# Altium schematic sheet motorcontroller updated (3).SchDoc
size A; SPICEModelCacheTQSCEQAL: <root> / <DocumentId>TQSCEQAL</DocumentId> / </root>
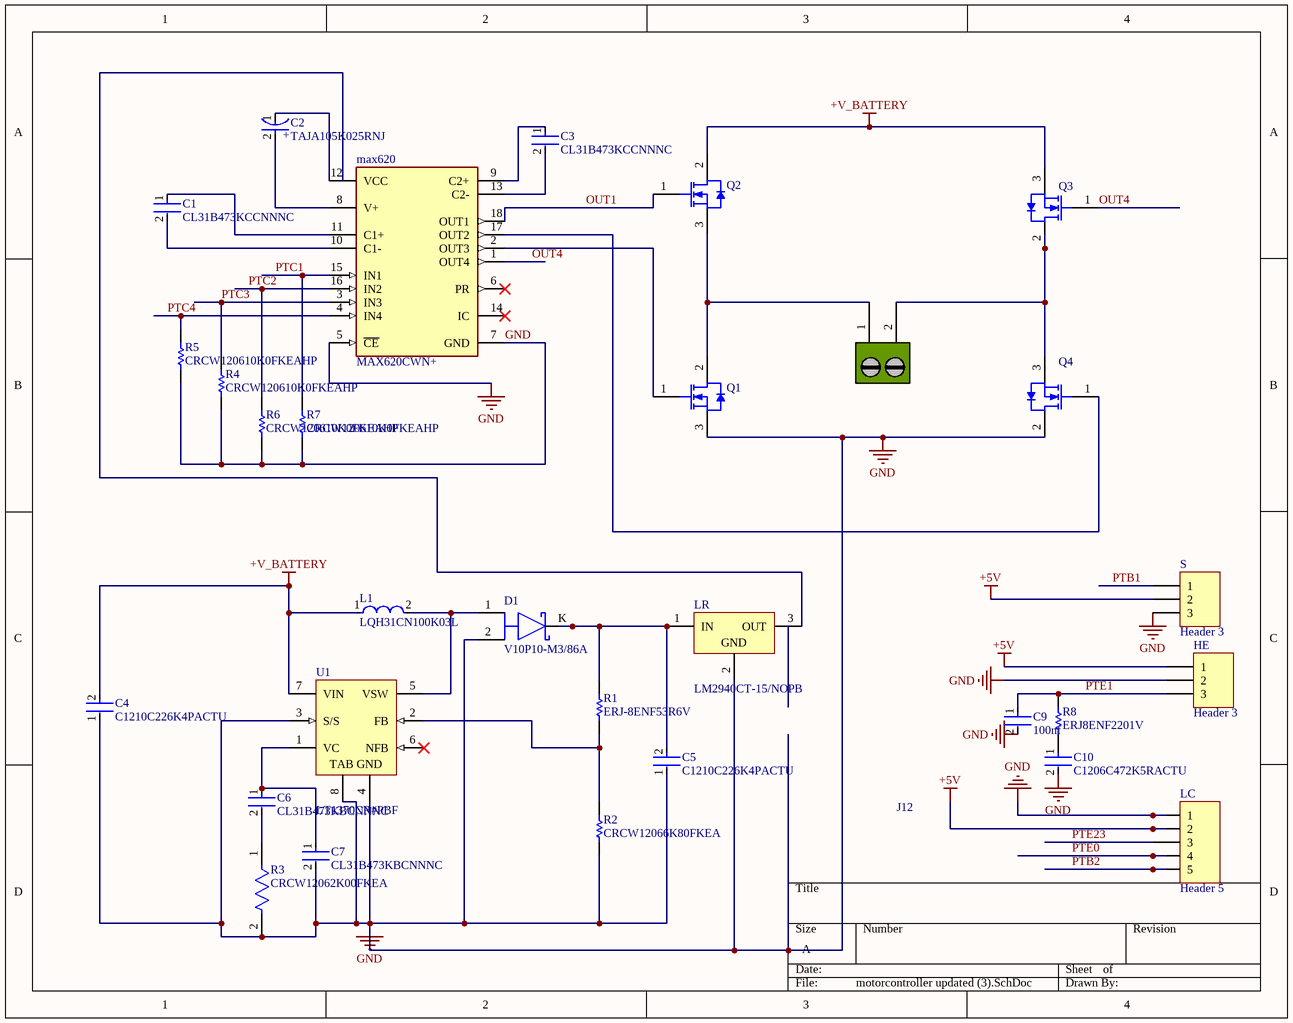
[diagram p0: motorcontroller updated (3).SchDoc]

## Parts
C1  CL31B473KCCNNNC  [FP-CL31-IPC_B]
C2  TAJA105K025RNJ  [FP-TAJA-MFG]
C3  CL31B473KCCNNNC  [FP-CL31-IPC_B]
C4  C1210C226K4PACTU  [FP-C1210C226K4PACTU-MFG]
C5  C1210C226K4PACTU  [FP-C1210C226K4PACTU-MFG]
C6  CL31B473KBCNNNC  [FP-CL31-IPC_B]
C7  CL31B473KBCNNNC  [FP-CL31-IPC_B]
C9  100nf  [FP-CL31-IPC_C]
C10  C1206C472K5RACTU  [FP-C1206C-EB-MFG]
D1  V10P10-M3/86A  [FP-95570-MFG]
HE  Header 3  [HDR1X3]
J12  (no value)  [282857-2]
L1  LQH31CN100K03L  [FP-LQH31CN_03-MFG]
LC  Header 5  [HDR1X5]
LR  LM2940CT-15/NOPB  [NDE0003A]
max620  MAX620CWN+  [FP-W18-1-MFG]
Q1  (no value)  [INF-PG-TO252-3-11_A_M]
Q2  (no value)  [INF-PG-TO252-3-11_A_M]
Q3  (no value)  [INF-PG-TO252-3-11_A_M]
Q4  (no value)  [INF-PG-TO252-3-11_A_M]
R1  ERJ-8ENF53R6V  [RESC3216X70X50NL05T20]
R2  CRCW12066K80FKEA  [RESC3216X60X45LL10T20]
R3  CRCW12062K00FKEA  [FP-CRCW1206-e3-IPC_A]
R4  CRCW120610K0FKEAHP  [RESC3116X65X50NL20T20]
R5  CRCW120610K0FKEAHP  [RESC3116X65X50NL20T20]
R6  CRCW120610K0FKEAHP  [RESC3116X65X50NL20T20]
R7  CRCW120610K0FKEAHP  [RESC3116X65X50NL20T20]
R8  ERJ8ENF2201V  [RESC3216X70X50NL05T20]
S  Header 3  [HDR1X3]
U1  LT1370CR#PBF  [LT-R-7_L]

## Nets
+5V: HE.1 LC.2 S.2
+V_BATTERY: C4.2 L1.1 Q2.2(DRAIN) Q3.3(SOURCE) U1.7(VIN)
GND: C4.1 C5.1 C7.2 C9.2 C10.2 D1.2(A) HE.2 LC.1 LR.2(GND) max620.5(~{CE}) max620.7(GND) Q1.3(SOURCE) Q4.2(DRAIN) R2.2 R3.2 R4.2 R5.1 R6.1 R7.2 S.3 U1.3(S/S) U1.4(GND) U1.8(TAB)
OUT1: max620.18(OUT1) Q2.1(GATE)
OUT4: max620.1(OUT4) Q3.1(GATE)
PTB1: S.1
PTB2: LC.5
PTC1: max620.15(IN1) R7.1
PTC2: max620.16(IN2) R6.2
PTC3: max620.3(IN3) R4.1
PTC4: max620.4(IN4) R5.2
PTE0: LC.4
PTE1: C9.1 HE.3 R8.2
PTE23: LC.3
NetC1_1: C1.1 max620.11(C1+)
NetC1_2: C1.2 max620.10(C1-)
NetC2_1: C2.1(C) max620.12(VCC)
NetC2_2: C2.2(A) max620.8(V+)
NetC3_1: C3.1 max620.9(C2+)
NetC3_2: C3.2 max620.13(C2-)
NetC5_2: C5.2 D1.K(C) LR.1(IN) R1.2
NetC6_1: C6.1 C7.1 U1.1(VC)
NetC6_2: C6.2 R3.1
NetC10_1: C10.1 R8.1
NetD1_1: D1.1(A) L1.2 U1.5(VSW)
NetJ12_1: J12.1 Q1.2(DRAIN) Q2.3(SOURCE)
NetJ12_2: J12.2 Q3.2(DRAIN) Q4.3(SOURCE)
Netmax620_2: max620.2(OUT3) Q1.1(GATE)
Netmax620_17: max620.17(OUT2) Q4.1(GATE)
NetR1_1: R1.1 R2.1 U1.2(FB)

Not connected (* = marked no-connect by the designer): LR 3(OUT); max620 6(PR)* 14(IC)*; U1 6(NFB)*

## Notes on the sheet
- (in symbol CMP-04424-000374-1) +

## Library data of the parts
C1 C3 = CMP-13271-001626-1: Cap Ceramic 47nF 100V X7R ±10% SMD 1206 +125°C Embossed T/R; Voltage: 63V; Mount: Surface Mount; Tolerance: 10%; Case Code (Imperial): 1206; Radiation Hardening: No; Material: Ceramic; Case Code (Metric): 3216; Voltage Rating: 100V; Packaging: Tape and Reel; Width: 0.063inch; Case/Package: 1206; Thickness: 0.039inch; Length: 3.2mm; Capacitance: 47nF; Max Operating Temperature: 125°C; Depth: 1.6mm; Height: 0.85mm; Dielectric: X7R; Package Quantity: 1; Min Operating Temperature: -55°C
C2 = CMP-04424-000374-1: 1uF 25V  ±10% 8Ω 1206  SMD Tantalum Capacitor; ESR (Equivalent Series Resistance): 8R; Leakage Current: 500nA; Dissipation Factor: 4%; Polarity: Polar; Tolerance: 20%; Dielectric: X7R; Termination: SMD/SMT; Series: TAJ; Depth: 1.6mm; Voltage Rating (DC): 25V; RoHS Compliant: Yes; Number of Pins: 2; Mount: Surface Mount; Case/Package: 1206; Features: General Purpose; Length: 3.2mm; Height - Seated (Max): 0.071inch; Dielectric Material: Tantalum; Width: 1.6mm; Case Code (Metric): 3216; Min Operating Temperature: -55°C; Max Operating Temperature: 125°C; Radiation Hardening: No; Capacitance: 1uF; Construction: Flat; Voltage: 25V; Height: 1.6mm; Package Quantity: 1; REACH SVHC: No SVHC; Packaging: Tape and Reel; Voltage Rating: 25V; Case Code (Imperial): 1206; Lead Free: Lead Free; Weight: 0.000571oz
C4 C5 = CMP-03020-034645-1: CAP CER 22UF 16V X5R 1210; Tolerance: 10%; Dielectric Material: Ceramic; Case Code (Metric): 3225; Mount: Surface Mount; Voltage: 16V; Construction: Flat; Lead Free: Lead Free; Radiation Hardening: No; Case Code (Imperial): 1210; Min Operating Temperature: -55°C; Height: 1.85mm; Termination: SMD/SMT; Voltage Rating (DC): 16V; Length: 3.2mm; Voltage Rating: 16V; Max Operating Temperature: 85°C; Packaging: Tape and Reel; RoHS Compliant: Yes; Capacitance: 22uF; Depth: 2.5mm; Case/Package: 1210; Dielectric: X5R
C6 C7 = CMP-13271-000358-1: Cap Ceramic 47nF 50V X7R ±10% SMD 1206 +125°C Embossed T/R; Case Code (Metric): 3216; Depth: 1.6mm; Mount: Surface Mount; Min Operating Temperature: -55°C; Case/Package: 1206; Height: 0.85mm; Packaging: Tape and Reel; Thickness: 0.039inch; Max Operating Temperature: 125°C; Dielectric: X7R; Case Code (Imperial): 1206; Material: Ceramic; Tolerance: 10%; Lead Free: Lead Free; Radiation Hardening: No; Voltage Rating (DC): 50V; Length: 3.2mm; Voltage Rating: 50V; Capacitance: 47nF; Width: 0.063inch; Voltage: 50V
C9 = CMP-13271-001514-1: Cap Ceramic 100nF 100V X7R ±10% SMD 1206 +125°C Embossed T/R; Manufacturer: Samsung; Manufacturer Part Number: CL31B104KCFNNNE; Mount: Surface Mount; Material: Ceramic; Radiation Hardening: No; Depth: 1.6mm; Min Operating Temperature: -55°C; Contact Plating: Tin; Case Code (Imperial): 1206; Voltage: 100V; Width: 0.063inch; Capacitance: 100nF; Voltage Rating: 100V; Packaging: Tape and Reel; Voltage Rating (DC): 100V; Length: 3.2mm; Thickness: 0.055inch; Height: 1.25mm; Package Quantity: 1; Dielectric: X7R; Max Operating Temperature: 125°C; Case Code (Metric): 3216; Lead Free: Lead Free; Case/Package: 1206; Tolerance: 10%; Supplier: Digi-Key; Supplier Part Number: 1276-1151-1-ND; RoHS: Yes; Category: Ceramic Capacitors; Stock: 549; Pricing: 1=0.12000, 10=0.08400, 50=0.04780, 100=0.03950, 500=0.02772, 1000=0.02295 (USD); Mounting Technology: Surface Mount; Value: 100nF; Series: CL; Construction: Flat; RoHS Compliant: Yes; ComponentLink1URL: https://datasheet.ciiva.com/25794/cl31b104kcfnnne-25794789.pdf?src-supplier=Digi-Key; ComponentLink1Description: https://datasheet.ciiva.com/25794/cl31b104kcfnnne-25794789.pdf?src-supplier=Digi-Key; ComponentLink2URL: https://datasheet.ciiva.com/16199/cl31b104kcfnnne-16199426.pdf?src-supplier=Future+Electronics; ComponentLink2Description: https://datasheet.ciiva.com/16199/cl31b104kcfnnne-16199426.pdf?src-supplier=Future+Electronics; ComponentLink3URL: https://datasheet.ciiva.com/26838/getdatasheetpartid-358426-26838891.pdf?src-supplier=Verical; ComponentLink3Description: https://datasheet.ciiva.com/26838/getdatasheetpartid-358426-26838891.pdf?src-supplier=Verical; ComponentLink4URL: https://datasheet.ciiva.com/29201/451915-da-01-en-vs-kondensator-1206-29201844.pdf?src-supplier=Conrad; ComponentLink4Description: https://datasheet.ciiva.com/29201/451915-da-01-en-vs-kondensator-1206-29201844.pdf?src-supplier=Conrad; ComponentLink5URL: https://datasheet.ciiva.com/26310/mlcc-catalogdownload2013-eng-26310106.pdf?src-supplier=Distrelec; ComponentLink5Description: https://datasheet.ciiva.com/26310/mlcc-catalogdownload2013-eng-26310106.pdf?src-supplier=Distrelec
C10 = CMP-03020-024307-1: CAP CER 4700PF 50V X7R 1206; Manufacturer: KEMET; Value: 4,700 pF; Tolerance: 0.1; Automotive Grade: Grade 0; Temperature Coefficient: 15%; Material: Ceramic; Device Class L1: Passive Components; Digikey Description: CAP CER 4700PF 50V X7R 1206; Temperature Range Low: -55°C; RoHS: TRUE; Temperature Range High: +150°C; Device Class L2: Capacitors; Category: Cap; Temperature Characteristic: X7R; Package: C1206C-EB; ComponentLink2URL: https://content.kemet.com/datasheets/KEM_C1007_X8R_ULTRA_150C_SMD.pdf; Height: 0.88mm; Voltage Rating: 50 V; Ipc Land Pattern Name: CAPC320160X78; ComponentLink2Description: Datasheet; Octopart: https://octopart.com/c1206c472k5ractu-kemet-104154; Automotive: Yes; Temperature: -55°C to +150°C; Lead Free: Yes; Manufacturer Part Number: C1206C472K5RACTU; Mouser Description: Multilayer Ceramic Capacitors MLCC - SMD/SMT 50volts 4700pF X7R 10%; Capacitance: 4,700 pF; Device Class L3: Ceramic Capacitors
D1 = CMP-2000-07483-2: DIODE SCHOTTKY 100V 10A TO277A; Manufacturer: Vishay; Max Junction Temp: +175°C; Max Surge Forward Current: 180A; Peak Reverse Current: 30.4uA; Digikey Description: DIODE SCHOTTKY 100V 10A TO277A; Manufacturer Part Number: V10P10-M3/86A; Device Class L1: Discrete Semiconductors; ComponentLink2Description: Datasheet; Reverse Voltage: 100V; Device Class L2: Diodes; Temperature Range Low: -40°C; Automotive: No; Package: 95570; Mouser Description: Diode Schottky 100V 10A 3-Pin(2+Tab) SMPC T/R; Lead Free: Yes; Footprint Url: https://www.vishay.com/docs/95570/to-277asmpc.pdf; Octopart: https://octopart.com/v10p10-m3%2F86a-vishay-42522004; Forward Current: 10A; Device Class L3: Schottky Diodes; RoHS: TRUE; Temperature Range High: +175°C; Temperature: -40°C to +175°C; ComponentLink2URL: http://www.vishay.com/docs/89006/v10p10.pdf; Category: Diode; Max Repetitive Reverse Voltage: 100V; Height: 1.2mm
HE S = Header 3: Header, 3-Pin; LatestRevisionDate: 17-Jul-2002; LatestRevisionNote: Re-released for DXP Platform.; Publisher: Altium Limited
J12 = 282857-2: Buchanan, Terminal Block Connector, 2 Position, 5.08 mm, 24A, 300 VAC, 30 to 12 AWG; Manufacturer: TE Connectivity; Number of Levels: 1; Positions Per Level: 2; Pitch: 0.200" (5.08mm); Mating Orientation: Horizontal with Board; Voltage: 300V; Wire Gauge: 12-30 AWG; Wire Termination: Screw - Rising Cage Clamp; Clamp Material - Plating: Brass - Nickel Plated; Torque - Screw: 0.79 Nm (7.0 Lb-In); Screw Thread: M3; Plating: Brass; Connector Type: Receptacle; Closed End: No (Without); Interlock: Yes (With); Max Voltage Rating (AC): 250V; Gender: Female; Wire Gauge (Max): 30AWG; Tail Length: 3.5mm; Supplier 1: Digi-Key; Supplier Part Number 1: A98359-ND; Manufacturer Part Number: 282857-2; RoHS: RoHS Compliant; Category: Connectors, Interconnects; Stock 1: 1811; Pricing 1: 1=1.19, 10=1.046, 25=0.984, 50=0.9432, 100=0.9021, 250=0.82012, 500=0.7381, 1000=0.65608, 2500=0.59457 (USD); Current: 24A; Mounting Type: Through Hole; Features: Interlocking (Side); Color: Green; Packaging: Bulk; Operating Temperature: -; Housing Material: Polyamide (PA66), Nylon 6/6; Contact Material - Plating: Brass - Tin Plated; Screw Material - Plating: Brass - Nickel Plated; ComponentLink1URL: http://documents.tycoelectronics.com/commerce/DocumentDelivery/DDEController?Action=srchrtrv&DocNm=282857&DocType=CD&DocLang=EN; ComponentLink1Description: http://documents.tycoelectronics.com/commerce/DocumentDelivery/DDEController?Action=srchrtrv&DocNm=282857&DocType=CD&DocLang=EN; Value: 282857-2; Supplier: Mouser; Supplier Part Number: 571-282857-2; Stock: 10247; Pricing: 1=1.77000, 10=1.34000, 50=1.34000, 100=1.09000, 1000=0.87100, 10000=0.69400 (USD); Mounting Technology: Through Hole; Contact Plating: Tin; Contact Material: Brass; Housing Color: Green; Material: Nylon; Termination: Screw; Number of Rows: 1; Package Quantity: 300; Number of Contacts: 2; Orientation: Straight; Series: Buchanan; Current Rating: 24A; Voltage Rating (AC): 300V; Number of Positions Per Level: 2; Number of Positions: 2; Number of Circuits: 2; Screw Flange: No (Without); Screwless Terminal Block: Yes (With); Side Stackable: Yes (With); Max Current Rating: 24A; Number of Poles: 2; Voltage Rating: 300V; Max Supply Voltage (AC): 250V; Length: 10.16mm; Width: 10mm; Wire Gauge (Min): 30AWG; Wire/Cable Gauge: 30AWG; Thread Size: M3; Depth: 10mm; Radiation Hardening: No; Flammability Rating: UL94 V-0; RoHS Compliant: Yes; ComponentLink2URL: https://datasheet.ciiva.com/16305/eng-cs-1308389-eurostyle-terminal-blocks-0607-16305272.pdf?src-supplier=Future+Electronics; ComponentLink2Description: https://datasheet.ciiva.com/16305/eng-cs-1308389-eurostyle-terminal-blocks-0607-16305272.pdf?src-supplier=Future+Electronics; ComponentLink3URL: https://datasheet.ciiva.com/823/eng-cd-282857-f1-823459.pdf?src-supplier=Digi-Key; ComponentLink3Description: https://datasheet.ciiva.com/823/eng-cd-282857-f1-823459.pdf?src-supplier=Digi-Key
L1 = CMP-06042-011996-1: Wire Wound Ferrite Inductor for Power Lines 10μH ±10% 1.69Ω 230mA 1206; DC Resistance (DCR): 1.3R; Shielding: Unshielded; Self Resonant Frequency: 20MHz; Current: 340mA; Test Frequency: 1MHz; Inductance: 10uH; Tolerance: 10%; Length: 3.5mm; Case Code (Metric): 3216; Lead Free: Lead Free; Military Standard: Not; Weight: 0.001023oz; DC Current: 230mA; Package Quantity: 2000; Max DC Current: 230mA; Min Operating Temperature: -25°C; Height: 1.8mm; Packaging: Tape and Reel; Case Code (Imperial): 1206; Mount: Surface Mount; Case/Package: 1206; Depth: 1.8mm; Inductance Tolerance: 10%; Number of Pins: 2; Resistor Type: Wirewound; Width: 1.6mm; Radiation Hardening: No; Max Operating Temperature: 85°C; REACH SVHC: No SVHC; Core Material: Ferrite; Current Rating: 230mA; Termination: SMD/SMT; Height - Seated (Max): 0.079inch
LC = Header 5: Header, 5-Pin; LatestRevisionDate: 17-Jul-2002; LatestRevisionNote: Re-released for DXP Platform.; Publisher: Altium Limited
LR = CMP-0062-02546-3: 1A Low Dropout Regulator, 3-pin TO-220, Pb-Free; Manufacturer: Texas Instruments; CompType: LDO IC; PackageTopMarking: NSUZXYTTE#*LM2940CT*-15 P+; PowerWise: N; PackageDescription: TO-220, Molded, 3 Lead, Straight; RoHS: Y; PackageReference: NDE0003A; ComponentLink1Description: Datasheet URL; PinCount: 3; ComponentLink1URL: http://www.ti.com/general/docs/lit/getliterature.tsp?genericPartNumber=LM2940C&fileType=pdf
max620 = CMP-05716-000008-1: IC GATE DRVR HIGH-SIDE 18SOIC; Nominal Supply Current: 500uA; Max Power Dissipation: 762mW; Fall Time: 2500ns; Max Output Current: 25mA; Rise Time: 1700ns; Min Supply Voltage: 4.5V; Max Supply Voltage: 16.5V; Number of Outputs: 4; Max Operating Temperature: 70°C; Packaging: Rail/Tube; Mount: Surface Mount; Lead Free: Lead Free; Min Operating Temperature: 0°C; Package Quantity: 40; Radiation Hardening: No; Number of Pins: 18; Max Supply Current: 500uA; Case/Package: SOIC; Supply Current: 500uA; RoHS Compliant: Yes; Number of Drivers: 4; Series: -
Q1-Q4 = CMP-1090-00096-1: N-Channel OptiMOS 3 Power-Transistor, 30 V VDS, 50 A ID, -55 to 175 degC, PG-TO252-3-11, Reel, Green; Manufacturer: Infineon; PartNumber: IPD060N03L G; Manufacturer Part Number: IPD060N03LG; VGS(th) (min): 1Â V; VGS(th) (max): 2.2Â V; Ptot (max): 56Â W; Green: TRUE; IDpuls (max): 350Â A; RthJC (max): 2.7Â K/W; RDS (on) (max) (@4.5V): 9Â mOhm; Polarity: N; RDS (on) (max): 6Â mOhm; RthJA (max): 75Â K/W; QG: 11.3Â nC; VDS (max): 30Â V; ID (max): 50Â A; Rds On Max: 6mR; Input Capacitance: 2.4nF; Rise Time: 3ns; Max Power Dissipation: 56W; Continuous Drain Current (ID): 50A; Turn-Off Delay Time: 20ns; Turn-On Delay Time: 5ns; Gate to Source Voltage (Vgs): 20V; Drain to Source Voltage (Vdss): 30V; Threshold Voltage: 10V; PackageVersion: Rev. 02, 03/2007; ComponentLink2URL: http://www.infineon.com/dgdl/IPD060N03LG_rev2.pdf?folderId=db3a304313b8b5a60113cee8763b02d7&fileId=db3a30432313ff5e01239e4d33a3702f; Rth: 2.7Â K/W; ComponentLink3Description: Package Specification; ComponentLink3URL: http://www.infineon.com/dgdl/IPD160N04L_rev1.0.pdf?folderId=db3a3043163797a6011643468e7505a4&fileId=db3a3043163797a60116436401cf05cf; Halogen-free: TRUE; ComponentLink1Description: Manufacturer URL; PackageDescription: 3-Pin Plastic (Green) Transistor Single Outline Package, 6.57 x 6.1 mm Body, 2.29 mm Pitch; ComponentLink1URL: http://www.infineon.com/; PackageReference: PG-TO252-3-11; Packing: Reel; ComponentLink2Description: Datasheet; Mounting Technology: Surface Mount; DatasheetVersion: Rev. 2.0; Supplier: Digi-Key; Supplier Part Number: IPD060N03LGATMA1CT-ND; RoHS: Yes; Category: Uncategorized; Stock: 3827; Pricing: 1=0.99000, 10=0.88700, 100=0.69120, 500=0.57096, 1000=0.45076 (USD); Case/Package: TO-252-3; Pins: 3; Min Operating Temperature: -55°C; Max Operating Temperature: 175°C; Packaging: Tape and Reel; Fall Time: 3ns; Series: OptiMOS™; Package Quantity: 2500; Power Dissipation: 56W; Drain to Source Breakdown Voltage: 30V; Drain to Source Resistance: 6mR; Length: 6.73mm; Width: 6.22mm; Height: 2.41mm; RoHS Compliant: Yes; Halogen Free: Halogen Free; Reach SVHC Compliant: No; ComponentLink4URL: https://datasheet.ciiva.com/13043/ipd060n03lg-rev1-03-93749-13043603.pdf?src-supplier=Mouser; ComponentLink4Description: https://datasheet.ciiva.com/13043/ipd060n03lg-rev1-03-93749-13043603.pdf?src-supplier=Mouser; ComponentLink5URL: https://datasheet.ciiva.com/25625/0900766b810908f2-25625241.pdf?src-supplier=Rs; ComponentLink5Description: https://datasheet.ciiva.com/25625/0900766b810908f2-25625241.pdf?src-supplier=Rs; ComponentLink6URL: https://datasheet.ciiva.com/940/ipd-f-s-u060n03l-g-940947.pdf?src-supplier=Digi-Key; ComponentLink6Description: https://datasheet.ciiva.com/940/ipd-f-s-u060n03l-g-940947.pdf?src-supplier=Digi-Key; ComponentLink7URL: https://datasheet.ciiva.com/940/ipd-f-s-u060n03l-g-940948.pdf?src-supplier=Digi-Key; ComponentLink7Description: https://datasheet.ciiva.com/940/ipd-f-s-u060n03l-g-940948.pdf?src-supplier=Digi-Key; ComponentLink8URL: https://datasheet.ciiva.com/940/ipd-f-s-u060n03l-g-940949.pdf?src-supplier=Digi-Key; ComponentLink8Description: https://datasheet.ciiva.com/940/ipd-f-s-u060n03l-g-940949.pdf?src-supplier=Digi-Key; ComponentLink9URL: https://datasheet.ciiva.com/11172/infineon-ipd060n03lg-ds-v02-01-en-11172172.pdf?src-supplier=Avnet; ComponentLink9Description: https://datasheet.ciiva.com/11172/infineon-ipd060n03lg-ds-v02-01-en-11172172.pdf?src-supplier=Avnet; ComponentLink10URL: https://datasheet.ciiva.com/8076/1859015-8076469.pdf?src-supplier=Element14; ComponentLink10Description: https://datasheet.ciiva.com/8076/1859015-8076469.pdf?src-supplier=Element14
R1 = CMP-2003-00419-1: Manufacturer: Panasonic; Part Number: ERJ-8ENF53R6V
R2 = CMP-2003-02358-1: Manufacturer: Vishay Dale; Part Number: CRCW12066K80FKEA
R3 = CMP-1014-00542-3: RES Thick Film, 2kΩ, 1%, 0.25W, 100ppm/°C, 1206; Manufacturer: Vishay; Max Power Dissipation: 250mW; Voltage Rating: 200V; Resistance: 2kR; Description: Res Thick Film 1206 2K Ohm 1% 1/4W ±100ppm/°C Molded SMD Paper T/R; Value: 2kR; Package Quantity: 10; Height: 0.55mm; Tolerance: 1%; Number of Terminations: 2; Mount: Surface Mount; Width: 1.6mm; Length: 3.2mm; Features: Automotive AEC-Q200; Contact Plating: Tin; Number of Pins: 2; Weight: 0.000353oz; Max Operating Temperature: 155°C; Min Operating Temperature: -55°C; Termination: SMD/SMT; Temperature Coefficient: 100ppm/°C; Case Code (Imperial): 1206; Depth: 1.6mm; Military Standard: Not; Case Code (Metric): 3216; Composition: Thick Film; Power Rating: 250mW; Case/Package: 1206; Radiation Hardening: No; Packaging: Tape and Reel; Supplier: Digi-Key; Supplier Part Number: 541-2.00KFCT-ND; Manufacturer Part Number: CRCW12062K00FKEA; RoHS: Yes; Category: Chip SMD Resistors; Stock: 62926; Pricing: 1=0.10000, 10=0.08000, 100=0.03080, 1000=0.01355, 2500=0.01170 (USD); Pins: 2; Series: CRCW; Resistor Type: Thick Film; Construction: Rectangular; Technology: THICK FILM; Resistance Tolerance: 1%; RoHS Compliant: Yes; Reach SVHC Compliant: Unknown; ComponentLink1URL: https://datasheet.ciiva.com/11811/0900766b80d98b5e-11811442.pdf?src-supplier=Rs; ComponentLink1Description: https://datasheet.ciiva.com/11811/0900766b80d98b5e-11811442.pdf?src-supplier=Rs; ComponentLink2URL: https://datasheet.ciiva.com/2468/dcrcwe3-2468916.pdf?src-supplier=Digi-Key; ComponentLink2Description: https://datasheet.ciiva.com/2468/dcrcwe3-2468916.pdf?src-supplier=Digi-Key; ComponentLink3URL: https://datasheet.ciiva.com/2468/dcrcwe3-2468917.pdf?src-supplier=Digi-Key; ComponentLink3Description: https://datasheet.ciiva.com/2468/dcrcwe3-2468917.pdf?src-supplier=Digi-Key; ComponentLink4URL: https://datasheet.ciiva.com/2468/dcrcwe3-2468918.pdf?src-supplier=Digi-Key; ComponentLink4Description: https://datasheet.ciiva.com/2468/dcrcwe3-2468918.pdf?src-supplier=Digi-Key; ComponentLink5URL: https://datasheet.ciiva.com/9093/dcrcwe3-9093517.pdf?src-supplier=Avnet; ComponentLink5Description: https://datasheet.ciiva.com/9093/dcrcwe3-9093517.pdf?src-supplier=Avnet; ComponentLink6URL: https://datasheet.ciiva.com/26821/getdatasheetpartid-45709-26821003.pdf?src-supplier=Verical; ComponentLink6Description: https://datasheet.ciiva.com/26821/getdatasheetpartid-45709-26821003.pdf?src-supplier=Verical; ComponentLink7URL: https://datasheet.ciiva.com/16770/70201119-16770157.pdf?src-supplier=Allied+Electronics; ComponentLink7Description: https://datasheet.ciiva.com/16770/70201119-16770157.pdf?src-supplier=Allied+Electronics; ComponentLink8URL: https://datasheet.ciiva.com/7673/1697337-7673390.pdf?src-supplier=Element14; ComponentLink8Description: https://datasheet.ciiva.com/7673/1697337-7673390.pdf?src-supplier=Element14; ComponentLink9URL: https://datasheet.ciiva.com/7673/125364-7673509.pdf?src-supplier=Element14; ComponentLink9Description: https://datasheet.ciiva.com/7673/125364-7673509.pdf?src-supplier=Element14
R4-R7 = CMP-2003-04883-1: Manufacturer: Vishay Dale; Part Number: CRCW120610K0FKEAHP
R8 = CMP-2003-00818-1: Manufacturer: Panasonic; Part Number: ERJ8ENF2201V
U1 = CMP-0491-01357-1: 500 kHz High Efficiency 6 A Switching Regulator, 7-pin DPAK (R-7), 0 to 125 degC, Pb-Free; Manufacturer: Linear Technology; Number of Outputs: 1; Frequency Sync Range: 600kHz - 800kHz; RoHS: TRUE; ComponentLink3URL: http://cds.linear.com/docs/en/packaging/05081462_F_R.pdf; PackageReference: R-7; PartNumber: LT1370CR#PBF; ComponentLink2Description: Datasheet; ComponentLink1Description: Manufacturer URL; PackageDescription: 7-Pin Plastic DD Pak, Body 10.2235 x 8.89 mm, Pitch 1.27 mm; ComponentLink2URL: http://cds.linear.com/docs/en/datasheet/1370fs.pdf; ComponentLink3Description: Package Specification; PackageVersion: Rev. F, 05/2012; ComponentLink1URL: http://www.linear.com/; Mounting Technology: Surface Mount